# Altium schematic sheet Sheet.SchDoc
size A4
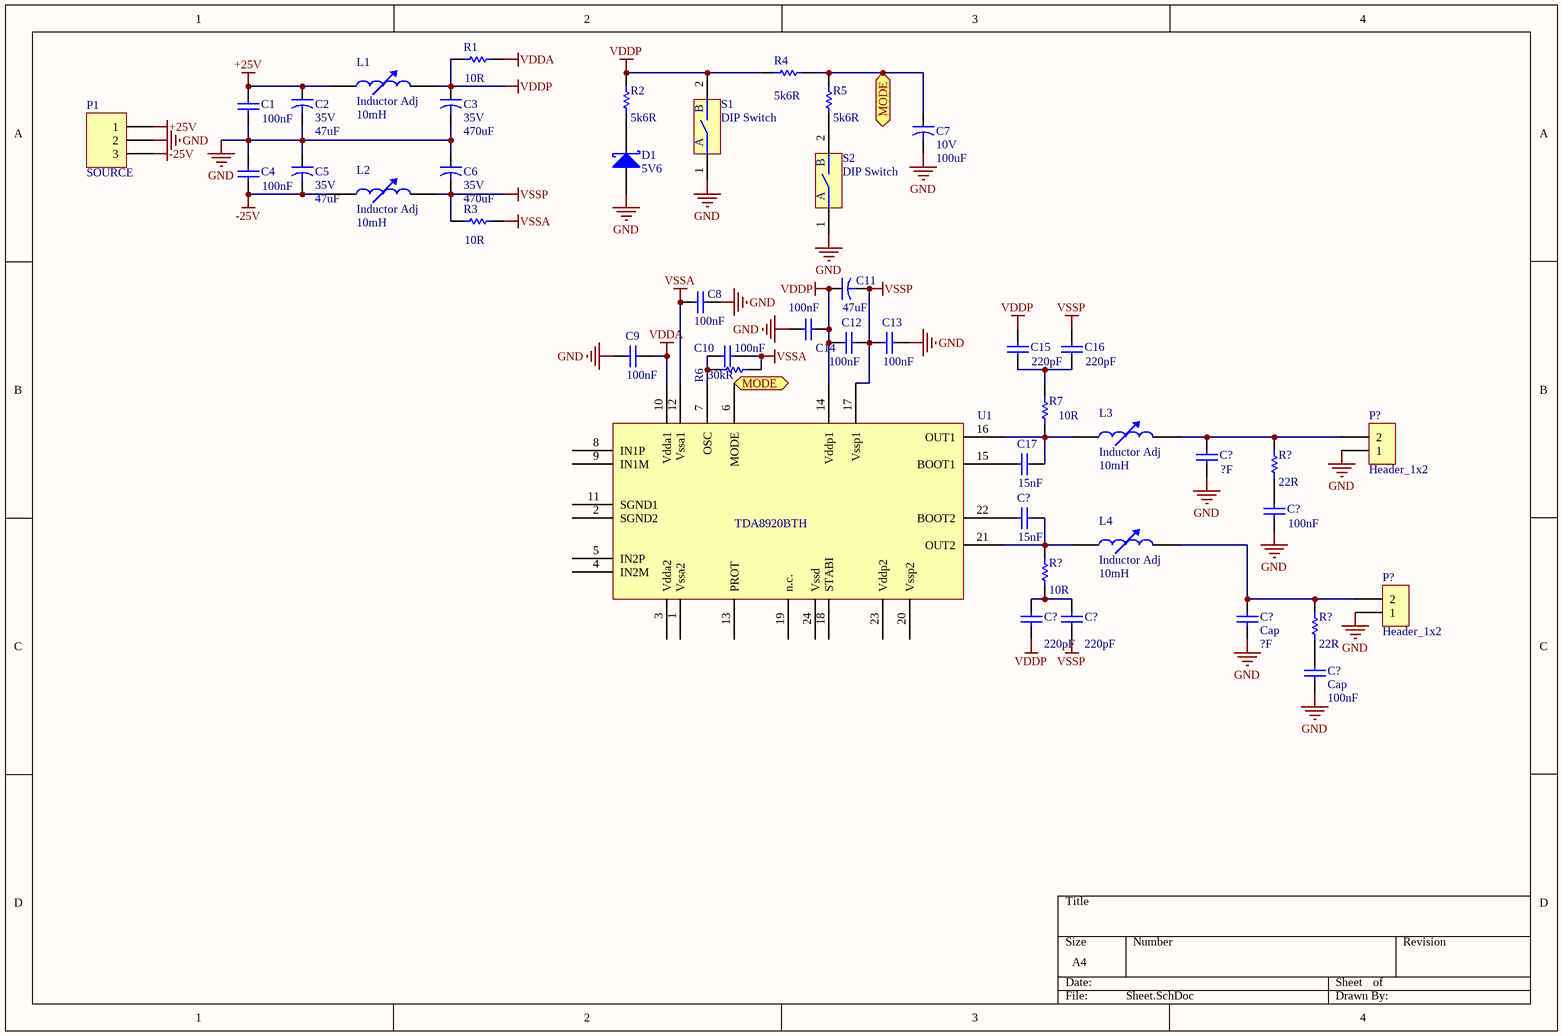
[diagram p0: Sheet.SchDoc]

## Parts
(Parts that share a designator on the sheet are numbered #1, #2 ... from top to bottom, then left to right.)
C1  value 100nF  [RAD-0.3]  (hidden comment: Cap)
C2  35V  value 47uF  [CAPR5-4X5]
C3  35V  value 470uF  [CAPR5-4X5]
C4  value 100nF  [RAD-0.3]  (hidden comment: Cap)
C5  35V  value 47uF  [CAPR5-4X5]
C6  35V  value 470uF  [CAPR5-4X5]
C7  10V  value 100uF  [CAPR5-4X5]
C8  value 100nF  [RAD-0.3]  (hidden comment: Cap)
C9  value 100nF  [RAD-0.3]  (hidden comment: Cap)
C10  value 100nF  [RAD-0.3]  (hidden comment: Cap)
C11  value 47uF  [CAPR5-4X5]  (hidden comment: Cap2)
C12  value 100nF  [RAD-0.3]  (hidden comment: Cap)
C13  value 100nF  [RAD-0.3]  (hidden comment: Cap)
C14  value 100nF  [RAD-0.3]  (hidden comment: Cap)
C15  value 220pF  [RAD-0.3]  (hidden comment: Cap)
C16  value 220pF  [RAD-0.3]  (hidden comment: Cap)
C17  value 15nF  [RAD-0.3]  (hidden comment: Cap)
C?#1  value ?F  [RAD-0.3]  (hidden comment: Cap)
C?#2  value 100nF  [RAD-0.3]  (hidden comment: Cap)
C?#3  value 15nF  [RAD-0.3]  (hidden comment: Cap)
C?#4  value 220pF  [RAD-0.3]  (hidden comment: Cap)
C?#5  value 220pF  [RAD-0.3]  (hidden comment: Cap)
C?#6  Cap  value ?F  [RAD-0.3]
C?#7  Cap  value 100nF  [RAD-0.3]
D1  5V6  [DO-204AL]
L1  Inductor Adj  value 10mH  [AXIAL-0.8]
L2  Inductor Adj  value 10mH  [AXIAL-0.8]
L3  Inductor Adj  value 10mH  [AXIAL-0.8]
L4  Inductor Adj  value 10mH  [AXIAL-0.8]
P1  SOURCE  [KRE_3]
P?#1  Header_1x2  [HDR-M-1x2-2.54mm-180-9.2mm]
P?#2  Header_1x2  [HDR-M-1x2-2.54mm-180-9.2mm]
R1  value 10R  [AXIAL-0.5]  (hidden comment: Res Semi)
R2  value 5k6R  [AXIAL-0.5]  (hidden comment: Res Semi)
R3  value 10R  [AXIAL-0.5]  (hidden comment: Res Semi)
R4  value 5k6R  [AXIAL-0.5]  (hidden comment: Res Semi)
R5  value 5k6R  [AXIAL-0.5]  (hidden comment: Res Semi)
R6  value 30kR  [AXIAL-0.3]  (hidden comment: Res1)
R7  value 10R  [AXIAL-0.3]  (hidden comment: Res1)
R?#1  value 22R  [AXIAL-0.5]  (hidden comment: Res Semi)
R?#2  value 10R  [AXIAL-0.5]  (hidden comment: Res Semi)
R?#3  value 22R  [AXIAL-0.5]  (hidden comment: Res Semi)
S1  DIP Switch  [DS01-300(100)-180]
S2  DIP Switch  [DS01-300(100)-180]
U1  U1  [PCB_TDA8920B]  (value not drawn)

## Ports
MODE (bidir)

## Nets
+25V: C1.2 C2.1 L1.1 P1.1
-25V: C4.1 C5.2 L2.1 P1.3
GND: C1.1 C2.2 C3.2 C4.2 C5.1 C6.1 C7.2 C8.2 C9.1 C13.2 C14.1 C?#1.2 C?#2.2 C?#6.1 C?#7.1 D1.1(A) P1.2 P?#1.1 P?#2.1 S1.1(1A) S2.1(1A)
VDDA: C9.2 R1.2 U1.10(Vdda1)
VDDP: C3.1 C11.1 C12.1 C14.2 C15.2 C?#4.1 L1.2 R1.1 R2.2 R4.1 S1.2(1B) U1.14(Vddp1)
VSSA: C8.1 C10.2 R3.2 R6.2 U1.12(Vssa1)
VSSP: C6.2 C11.2 C12.2 C13.1 C16.2 C?#5.1 L2.2 R3.1 U1.17(Vssp1)
MODE: C7.1 R4.2 R5.2 U1.6(MODE) ; port MODE
NetC10_1: C10.1 R6.1 U1.7(OSC)
NetC15_1: C15.1 C16.1 R7.2
NetC17_1: C17.1 U1.15(BOOT1)
NetC17_2: C17.2 L3.1 R7.1 U1.16(OUT1)
NetC?#1_1: C?#1.1 L3.2 P?#1.2 R?#1.2
NetC?#2_1: C?#2.1 R?#1.1
NetC?#3_1: C?#3.1 L4.1 R?#2.2 U1.21(OUT2)
NetC?#3_2: C?#3.2 U1.22(BOOT2)
NetC?#4_2: C?#4.2 C?#5.2 R?#2.1
NetC?#6_2: C?#6.2 L4.2 P?#2.2 R?#3.2
NetC?#7_2: C?#7.2 R?#3.1
NetD1_2: D1.2(K) R2.1
NetR5_1: R5.1 S2.2(1B)

Not connected (* = marked no-connect by the designer): U1 1(Vssa2) 2(SGND2) 3(Vdda2) 4(IN2M) 5(IN2P) 8(IN1P) 9(IN1M) 11(SGND1) 13(PROT) 18(STABI) 19(n.c.) 20(Vssp2) 23(Vddp2) 24(Vssd)

## Notes on the sheet
- (in symbol DIP_Switch_1) B; A

## Library data of the parts
C1 C4 C8-C10 C12-C17 C?#1-C?#7 = Cap: Capacitor; Published: 8-Jun-2000; LatestRevisionDate: 17-Jul-2002; LatestRevisionNote: Re-released for DXP Platform.; PackageReference: RAD-0.3; Publisher: Altium Limited; PackageDescription: Radial Cap, Thru-Hole; 2 Leads; 0.3 in Pin Spacing
C2 C3 C5-C7 C11 = Cap2: Capacitor; Published: 23-Sep-2002; PackageReference: CAPR5-4X5; Publisher: Altium Limited; PackageDescription: Capacitor; 2 Leads
D1 = Diode 11DQ03: Schottky Rectifier; Published: 8-Jun-2000; LatestRevisionDate: 17-Jul-2002; LatestRevisionNote: Re-released for DXP Platform.; DatasheetVersion: Dec-1997; PackageReference: DO-204AL; Publisher: Altium Limited; PackageDescription: Diode, Axial; Body 5.2 x 2.7 mm (LxDia. max), Lead Dia. 0.86 mm (max); Code_JEDEC: DO-204-AL; ComponentLink1Description: Manufacturer Link; ComponentLink1URL: http://www.irf.com/; ComponentLink2Description: Datasheet; ComponentLink2URL: http://www.irf.com/product-info/datasheets/data/11dq03.pdf
L1-L4 = Inductor Adj: Adjustable Inductor; Set Position: 0.5; Published: 24-Mar-1999; LatestRevisionDate: 17-Jul-2002; LatestRevisionNote: Re-released for DXP Platform.; PackageReference: AXIAL-0.8; Publisher: Altium Limited; PackageDescription: Axial Device, Thru-Hole; 2 Leads; 0.8 in Pin Spacing
P1 = KRE_3: Terminal Block 1x3
P?#1 P?#2 = Header_1x2: Header, 1 Line, 2 Columns, 2 Pins; LatestRevisionDate: 17-Jul-2002; LatestRevisionNote: Re-released for DXP Platform.; Publisher: Altium Limited
R1-R5 R?#1-R?#3 = Res Semi: Semiconductor Resistor; Published: 8-Jun-2000; LatestRevisionDate: 17-Jul-2002; LatestRevisionNote: Re-released for DXP Platform.; PackageReference: AXIAL-0.5; Publisher: Altium Limited; PackageDescription: Axial Device, Thru-Hole; 2 Leads; 0.5 in Pin Spacing
R6 R7 = Res1: Resistor; Published: 8-Jun-2000; LatestRevisionDate: 17-Jul-2002; LatestRevisionNote: Re-released for DXP Platform.; PackageReference: AXIAL-0.3; Publisher: Altium Limited; PackageDescription: Axial Device, Thru-Hole; 2 Leads; 0.3 in Pin Spacing
S1 S2 = DIP_Switch_1: DIP SWITCH 1 switch
U1 = TDA8920BTH: Supplier 1: Digi-Key; Supplier Part Number 1: 568-2060-2-ND